# Altium project pca20035.PrjPCB (part 3 of 4)

## Sheet pca20035_sheet6_interface.SchDoc: Thingy:91 Interface
size A3; Organization: Nordic Semiconductor; DocumentNumber: 6; Revision: 1.6.0; SheetNumber: 6; SheetTotal: 6; Author: RUBR; CompanyName: Nordic Semiconductor; DrawnBy: RUBR; DocumentSize: A3; ProjectName: nRF91 Thingy
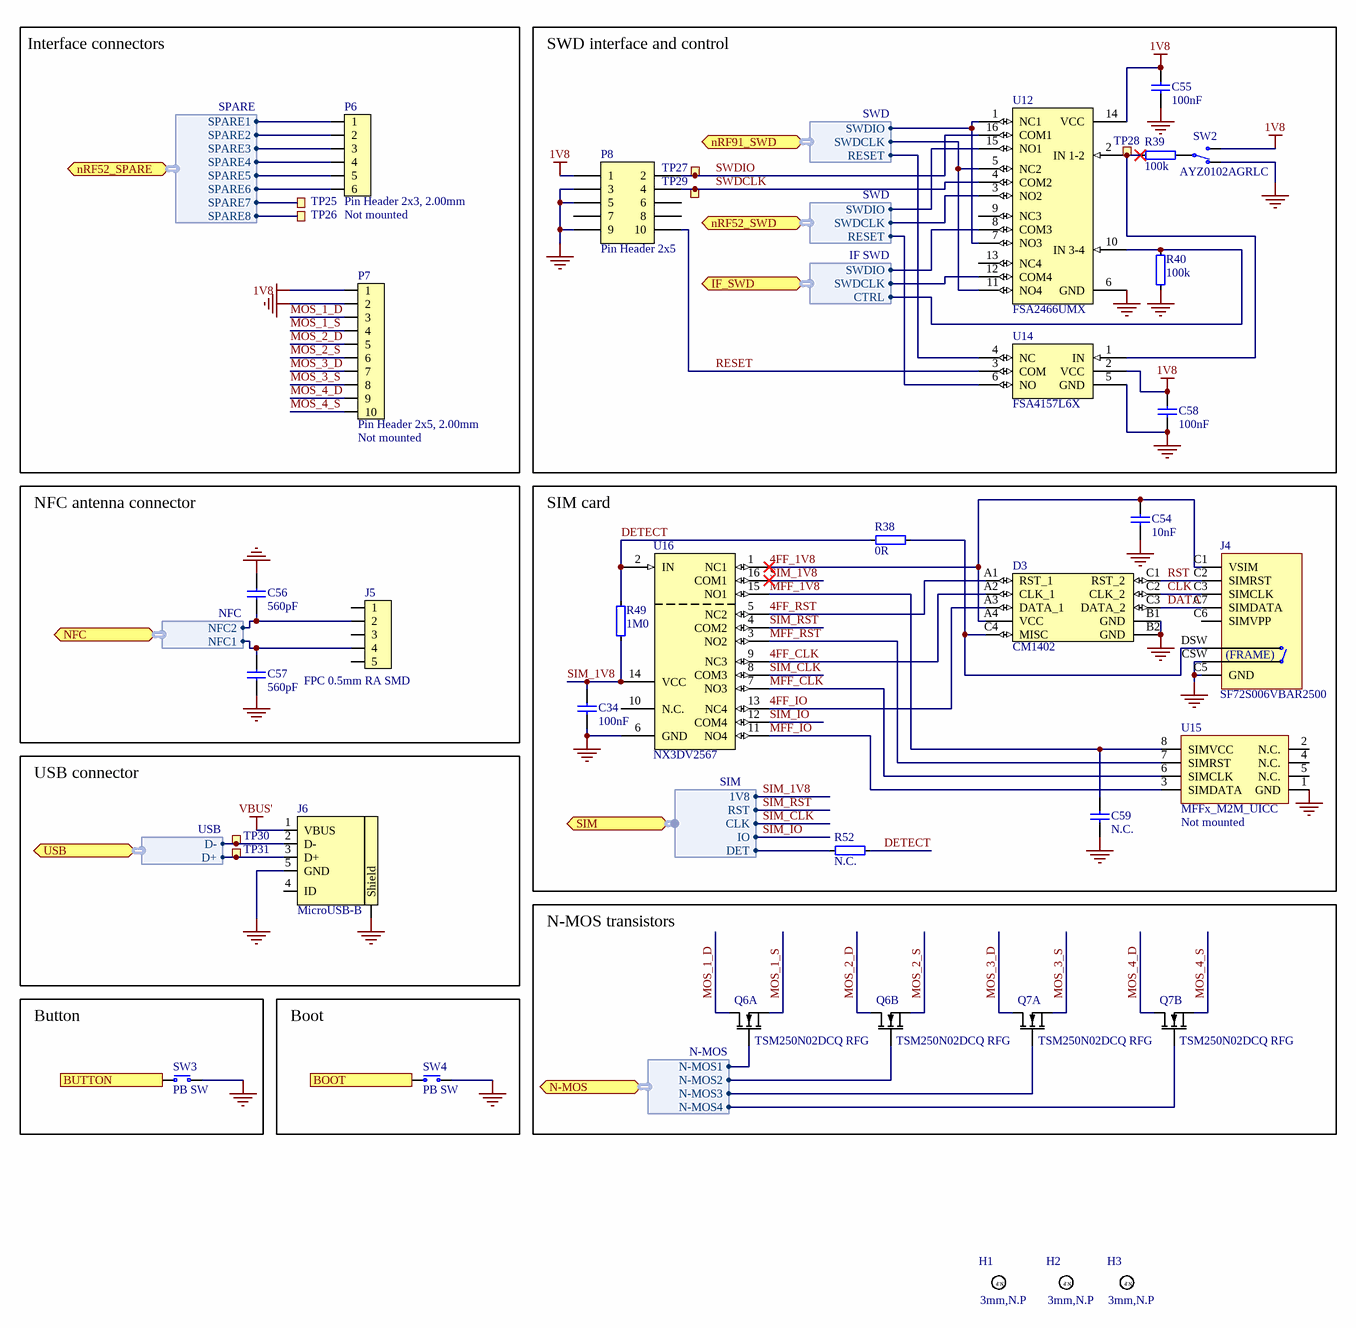
[diagram p4: pca20035_sheet6_interface.SchDoc]

### Parts
C34  100nF  [CAPC0603X03L_C]
C54  10nF  [CAPC0603X03L_C]
C55  100nF  [CAPC0603X03L_C]
C56  560pF  [CAPC0603X03L_C]
C57  560pF  [CAPC0603X03L_C]
C58  100nF  [CAPC0603X03L_C]
C59  N.C.  [CAPC0603X03L_C_NC]
D3  CM1402  [CM1402]
H1  3mm,N.P  [HOLE_NP_3MM]  (no BOM)
H2  3mm,N.P  [HOLE_NP_3MM]  (no BOM)
H3  3mm,N.P  [HOLE_NP_3MM]  (no BOM)
J4  SF72S006VBAR2500  [SF72S006VBAR2500]
J5  FPC 0.5mm RA SMD  [FPC_05P-0.5mm-RA-SMD]
J6  MicroUSB-B  [USB-Micro-B-RA-SMD-PiP]
P6  Pin Header 2x3, 2.00mm  Assembly: Not mounted  [HDR_2x3_TH_2.00MM-NC]
P7  Pin Header 2x5, 2.00mm  Assembly: Not mounted  [HDR_2x5_TH_2.00MM-NC]
P8  Pin Header 2x5  [HDR_2x5-SMD-1.27mm-ANG]
Q6  TSM250N02DCQ RFG  [DFN65P200X200X80_HS-6N]  (parts A,B of 2)
Q7  TSM250N02DCQ RFG  [DFN65P200X200X80_HS-6N]  (parts A,B of 2)
R38  0R  [RESC0603X03L_C]
R39  100k  [RESC0603X03L_C]
R40  100k  [RESC0603X03L_C]
R49  1M0  [RESC0603X03L_C]
R52  N.C.  [RESC0603X03L_C_NC]
SW2  AYZ0102AGRLC  [AYZ0102AGRLC]
SW3  PB SW  [Switch-PB-6.2x6.3mm-SMD]
SW4  PB SW  [SW_TACTILE_2.6x3.0MM_4-LEAD]
TP25  Ø1.0mm,SMD  [TP_SMD_Ø1.0mm]  (value not drawn)  (no BOM)
TP26  Ø1.0mm,SMD  [TP_SMD_Ø1.0mm]  (value not drawn)  (no BOM)
TP27  Ø1.5mm,SMD  [TP_SMD_Ø1.5mm]  (value not drawn)  (no BOM)
TP28  Ø1.5mm,SMD  [TP_SMD_Ø1.5mm]  (value not drawn)  (no BOM)
TP29  Ø1.5mm,SMD  [TP_SMD_Ø1.5mm]  (value not drawn)  (no BOM)
TP30  Ø1.5mm,SMD  [TP_SMD_Ø1.5mm]  (value not drawn)  (no BOM)
TP31  Ø1.5mm,SMD  [TP_SMD_Ø1.5mm]  (value not drawn)  (no BOM)
U12  FSA2466UMX  [XQFN40P180X260X50-16N]
U14  FSA4157L6X  [PSON50P100X60-6N]
U15  MFFx_M2M_UICC  Assembly: Not mounted  [SON127P600X90_HS-8N]
U16  NX3DV2567  [XQFN40P180X260X50-16N]

### Blocks framed on the sheet
Interface connectors: P6 P7 TP25 TP26
SWD interface and control: C55 C58 P8 R39 R40 SW2 TP27-TP29 U12 U14
NFC antenna connector: C56 C57 J5
SIM card: C34 C54 C59 D3 J4 R38 R49 R52 U15 U16
USB connector: J6 TP30 TP31
N-MOS transistors: Q6 Q7
Button: SW3
Boot: SW4

### Ports
BOOT (out), BUTTON (out), IF_SWD (bidir, harness IF SWD), N-MOS (bidir, harness N-MOS), NFC (bidir, harness NFC), nRF52_SPARE (bidir, harness SPARE), nRF52_SWD (bidir, harness SWD), nRF91_SWD (bidir, harness SWD), SIM (bidir, harness SIM), USB (bidir, harness USB)

### Harnesses
SWD: SWDIO, SWDCLK, RESET
IF SWD: SWDIO, SWDCLK, CTRL
NFC: NFC2, NFC1
N-MOS: N-MOS1, N-MOS2, N-MOS3, N-MOS4
SPARE: SPARE1, SPARE2, SPARE3, SPARE4, SPARE5, SPARE6, SPARE7, SPARE8
USB: D-, D+
SIM: DET, RST, CLK, IO, 1V8

### Nets
1V8: C55.1 C58.1 P7.1 P8.1 SW2.3(N.O) U12.14(VCC) U14.2(VCC)
GND: C34.1 C54.2 C55.2 C56.2 C57.1 C58.2 C59.1 D3.B1(GND) D3.B2(GND) J4.0(GND) J4.C5(GND) J4.CSW J6.5(GND) J6.6(Shield) P7.2 P8.3 P8.5 P8.9 R40.2 SW2.1(N.C) SW3.1(N.O) SW4.1(N.O) U12.6(GND) U14.5(GND) U15.1(GND) U16.6(GND)
VBUS': J6.1(VBUS)
4FF_1V8: C54.1 D3.A4(VCC) J4.C1(VSIM) U16.1(NC1)
4FF_CLK: D3.A2(CLK_1) U16.9(NC3)
4FF_IO: D3.A3(DATA_1) U16.13(NC4)
4FF_RST: D3.A1(RST_1) U16.5(NC2)
CLK: D3.C2(CLK_2) J4.C3(SIMCLK)
D_N: J6.2(D-) TP30.1 ; port USB.D-
D_P: J6.3(D+) TP31.1 ; port USB.D+
DATA: D3.C3(DATA_2) J4.C7(SIMDATA)
DETECT: R38.2 R49.1 R52.1 U16.2(IN)
MFF_1V8: C59.2 U15.8(SIMVCC) U16.15(NO1)
MFF_CLK: U15.6(SIMCLK) U16.7(NO3)
MFF_IO: U15.3(SIMDATA) U16.11(NO4)
MFF_RST: U15.7(SIMRST) U16.3(NO2)
MOS_1_D: P7.3 Q6.6(D1)
MOS_1_S: P7.4 Q6.1(S1)
MOS_2_D: P7.5 Q6.3(D2)
MOS_2_S: P7.6 Q6.4(S2)
MOS_3_D: P7.7 Q7.6(D1)
MOS_3_S: P7.8 Q7.1(S1)
MOS_4_D: P7.9 Q7.3(D2)
MOS_4_S: P7.10 Q7.4(S2)
nRF52_P0.03: TP25.1 ; port nRF52_SPARE.SPARE7
nRF52_P0.05: P6.2 ; port nRF52_SPARE.SPARE2
nRF52_P0.06: P6.1 ; port nRF52_SPARE.SPARE1
nRF52_P0.09: C57.2 J5.4 ; port NFC.NFC1
nRF52_P0.10: C56.1 J5.2 ; port NFC.NFC2
nRF52_P0.14: U12.8(COM3) ; port IF_SWD.SWDIO
nRF52_P0.17: R40.1 U12.10(IN_3-4) ; port IF_SWD.CTRL
nRF52_P0.26: P6.3 ; port nRF52_SPARE.SPARE3
nRF52_P0.27: P6.4 ; port nRF52_SPARE.SPARE4
nRF52_P0.28: P6.5 ; port nRF52_SPARE.SPARE5
nRF52_P0.30: P6.6 ; port nRF52_SPARE.SPARE6
nRF52_P1.05: U12.12(COM4) ; port IF_SWD.SWDCLK
nRF52_P1.11: TP26.1 ; port nRF52_SPARE.SPARE8
nRF52_P1.13: SW4.2(COM) ; port BOOT
nRF52_RST: U14.6(NO) ; port nRF52_SWD.RESET
nRF52_SWDCLK: U12.3(NO2) ; port nRF52_SWD.SWDCLK
nRF52_SWDIO: U12.15(NO1) ; port nRF52_SWD.SWDIO
nRF91_RST: U14.4(NC) ; port nRF91_SWD.RESET
nRF91_SWDCLK: U12.5(NC2) U12.11(NO4) ; port nRF91_SWD.SWDCLK
nRF91_SWDIO: U12.1(NC1) U12.7(NO3) ; port nRF91_SWD.SWDIO
P0.13/AIN0: Q6.2(G1) ; port N-MOS.N-MOS1
P0.14/AIN1: Q6.5(G2) ; port N-MOS.N-MOS2
P0.15/AIN2: Q7.2(G1) ; port N-MOS.N-MOS3
P0.16/AIN3: Q7.5(G2) ; port N-MOS.N-MOS4
P0.26: SW3.2(COM) ; port BUTTON
RESET: P8.10 U14.3(COM)
RST: D3.C1(RST_2) J4.C2(SIMRST)
SIM_1V8: C34.2 R49.2 U16.14(VCC) U16.16(COM1) ; port SIM.1V8
SIM_CLK: U16.8(COM3) ; port SIM.CLK
SIM_DET: R52.2 ; port SIM.DET
SIM_IO: U16.12(COM4) ; port SIM.IO
SIM_RST: U16.4(COM2) ; port SIM.RST
SWDCLK: P8.4 TP29.1 U12.4(COM2)
SWDIO: P8.2 TP27.1 U12.16(COM1)
NetD3_C4: D3.C4(MISC) J4.DSW R38.1
NetR39_1: R39.1 SW2.2(COM)
NetR39_2: R39.2 TP28.1 U12.2(IN_1-2) U14.1(IN)

Not connected (* = marked no-connect by the designer): H1 1; H2 1; H3 1; J4 C6(SIMVPP); J5 1 3 5; J6 4(ID); P8 6 7 8; U12 9(NC3) 13(NC4); U15 2(N.C.) 4(N.C.) 5(N.C.); U16 10(N.C.)

### Notes on the sheet
- Size
- Date:
- A3
- Project Number
- Sheet         of
- Revision
- File:
- Drawn By:
- (in symbol Hole_3MM_NP) N.P
- (in symbol SF72S006VBAR2500) (FRAME)

### Library data of the parts
C34 C55 C58 = C0201-100n: as C2 on sheet pca20035_sheet2_nrf91_mcu; Part Number: C0201-100n; Manufacturer Part Number: N.A.; ComponentLink1URL: N.A.; ComponentLink1Description: Datasheet; ComponentLink2URL: N.A.; ComponentLink2Description: Supplier link; HelpURL: N.A.; Footprint Doc: 0201; LatestRevisionDate: 2017-11-09; Published: 2014-11-13; Value: 100nF; Artikkelnr Noca: N.A.; Supplier 1: N.A.; Supplier Part Number 1: N.A.; Supplier 2: N.A.; Supplier Part Number 2: N.A.; Component Class: Capacitors; PartId: 100200078
C54 = C0201-10n: Capacitor, X7R, ±10%; Manufacturer: N.A.; Part number IPS: 00000003480; Note: 10V; Pad Count: 2; Part Number: C0201-10n; Manufacturer Part Number: N.A.; Footprint Doc: 0201; LatestRevisionDate: 2017-11-09; Published: 2014-11-13; Value: 10nF; Artikkelnr Noca: N.A.; ComponentLink1URL: N.A.; ComponentLink1Description: Datasheet; ComponentLink2URL: N.A.; ComponentLink2Description: Supplier link; HelpURL: N.A.; Supplier 1: N.A.; Supplier Part Number 1: N.A.; Supplier 2: N.A.; Supplier Part Number 2: N.A.; Component Class: Capacitors; PartId: 100200067
C56 C57 = C0201-560p: Capacitor, NP0, ±5%, 25V; Manufacturer: N.A.; Part number IPS: 00000001808; Pad Count: 2; Part Number: C0201-560p; Manufacturer Part Number: N.A.; Footprint Doc: 0201; LatestRevisionDate: 2020-12-16; Published: 2014-11-13; Value: 560pF; Note: 25V; Artikkelnr Noca: N.A.; ComponentLink1URL: N.A.; ComponentLink1Description: Datasheet; ComponentLink2URL: N.A.; ComponentLink2Description: Supplier link; HelpURL: N.A.; Supplier 1: N.A.; Supplier Part Number 1: N.A.; Supplier 2: N.A.; Supplier Part Number 2: N.A.; Component Class: Capacitors; PartId: 100200053
C59 = C0201-N.C.: Not mounted; Manufacturer: N.A.; Note: Chip Cap; Assembly: Not mounted; Pad Count: 2; Part Number: C0201-N.C.; Manufacturer Part Number: N.A.; ComponentLink1URL: N.A.; ComponentLink1Description: Datasheet; ComponentLink2URL: N.A.; ComponentLink2Description: Supplier link; HelpURL: N.A.; Footprint Doc: 0201; LatestRevisionDate: 2014-11-13; Published: 2014-11-13; Value: N.C.; Artikkelnr Noca: N.A.; Part number IPS: N.A.; Supplier 1: N.A.; Supplier Part Number 1: N.A.; Supplier 2: N.A.; Supplier Part Number 2: N.A.; Component Class: Capacitors; PartId: 100200001
D3 = CM1402: EMI Network Filter Arrays SIM CARD EMI FILTER WITH ESD PROTECTION; Manufacturer: ON Semiconductor; Manufacturer Part Number: CM1402-03CP; Part number IPS: 00000009949; Note: N.A.; Pad Count: 10; Part Number: CM1402; Footprint Doc: CM1402; LatestRevisionDate: 2017-02-06; Published: 2017-02-06; Value: CM1402; Artikkelnr Noca: N.A.; ComponentLink1URL: N.A.; ComponentLink1Description: Datasheet; ComponentLink2URL: N.A.; ComponentLink2Description: Supplier link; HelpURL: http://www.onsemi.com/pub_link/Collateral/CM1402-D.PDF; Supplier 1: Digi-Key; Supplier Part Number 1: CM1402-03CPOSTR-ND; Supplier 2: Mouser; Supplier Part Number 2: 748-CM1402-03CP; Component Class: Semiconductors; PartId: 101300139
H1-H3 = Hole_3MM_NP: Regular Non-Plated, 3mm hole; Manufacturer: Nordic Semiconductor; Manufacturer Part Number: N.A.; Pad Count: 1; Part Number: Hole_3MM_NP; Footprint Doc: Hole_3MM_NP; LatestRevisionDate: 2009-12-12; Published: 2009-12-12; Value: 3mm,N.P; Note: Regular Non-Plated, 3mm hole; Artikkelnr Noca: N.A.; Part number IPS: N.A.; ComponentLink1URL: N.A.; ComponentLink1Description: Datasheet; ComponentLink2URL: N.A.; ComponentLink2Description: Supplier link; HelpURL: N.A.; Supplier 1: N.A.; Supplier Part Number 1: N.A.; Supplier 2: N.A.; Supplier Part Number 2: N.A.; Component Class: Connectors; PartId: 100500145
J4 = SF72S006VBAR2500: n 8 (6 + 2) Position Card Connector NANO SIM Surface Mount, Right Angle Gold; Manufacturer: JAE Electronics; Part number IPS: 00000009956; Note: N.A.; Pad Count: 8; Part Number: SF72S006VBAR2500; Manufacturer Part Number: SF72S006VBAR2500; Footprint Doc: SF72S006VBAR2500; LatestRevisionDate: 2016-09-09; Published: 2016-09-09; Value: SF72S006VBAR2500; Artikkelnr Noca: N.A.; ComponentLink1URL: N.A.; ComponentLink1Description: Datasheet; ComponentLink2URL: N.A.; ComponentLink2Description: Supplier link; HelpURL: http://jae-connectors.com/en/pdf/MB-0282-1E_SF72.pdf; Supplier 1: Digi-Key; Supplier Part Number 1: 670-2799-1-ND; Supplier 2: Mouser; Supplier Part Number 2: 656-SF72S006VBAR2500; Component Class: Connectors; PartId: 100500572
J5 = FPC_05P-0.5mm-RA-SMD: 0.5mm FPC, 5P,Right Angle SMT,Double Contact,H=1.2mm,White, Tin plated; Manufacturer: W-CON; Manufacturer Part Number: 5141-05RZDNWR01; Part number IPS: 00000007792; Note: N.A.; Artikkelnr Noca: 55010020; Pad Count: 7; Part Number: FPC_05P-0.5mm-RA-SMD; Footprint Doc: FPC_05P-0.5mm-RA-SMD; LatestRevisionDate: 2016-04-21; Published: 2015-06-22; Value: FPC 0.5mm RA SMD; ComponentLink1URL: N.A.; ComponentLink1Description: Datasheet; ComponentLink2URL: N.A.; ComponentLink2Description: Supplier link; HelpURL: \\hizz\pro\app9717\Datasheet\connectors\W-CON\5141-XXRZDNXX0X.pdf; Supplier 1: Cabcon; Supplier Part Number 1: 5141-05RZDNWR01; Supplier 2: Digi-Key; Supplier Part Number 2: WM9836CT-ND; Component Class: Connectors; PartId: 100500528
J6 = USB-Micro-B-RA-SMD-PiP: MicroUSB-B-SMT; Manufacturer: Allen Creations Corp.; Manufacturer Part Number: AJU55-BS2111-L; Part number IPS: 00000007790; Note: N.A.; Artikkelnr Noca: 55029020; Pad Count: 5; Part Number: USB-Micro-B-RA-SMD-PiP; Footprint Doc: USB-Micro-B-RA-SMD-PiP; LatestRevisionDate: 2016-04-21; Published: 2014-10-07; Value: MicroUSB-B; ComponentLink1URL: N.A.; ComponentLink1Description: Datasheet; ComponentLink2URL: N.A.; ComponentLink2Description: Supplier link; HelpURL: \\hizz\pro\app9717\Datasheet\connectors\Allen Creations Corp\AJU-211.pdf; Supplier 1: Cabcon; Supplier Part Number 1: AJU55-BS2111-L; Supplier 2: Digi-Key; Supplier Part Number 2: 609-4616-1-ND; Component Class: Connectors; PartId: 100500490
P6 = Pin Header 2x3 TH, 2.00mm, N.C.: Pin Header 2x3, TH, 2.00mm; Manufacturer: N.A.; Pad Count: 6; Part Number: Pin Header 2x3 TH, 2.00mm, N.C.; Manufacturer Part Number: N.A.; ComponentLink1URL: N.A.; ComponentLink1Description: Datasheet; ComponentLink2URL: N.A.; ComponentLink2Description: Supplier link; HelpURL: N.A.; Footprint Doc: HDR_2x3_TH_2.00MM-NC; LatestRevisionDate: 2019-01-21; Published: 2019-01-21; Value: Pin Header 2x3, 2.00mm; Note: N.A.; Supplier 1: N.A.; Supplier Part Number 1: N.A.; Supplier 2: N.A.; Supplier Part Number 2: N.A.; Artikkelnr Noca: N.A.; Part number IPS: N.A.; Component Class: Connectors; PartId: 100500247
P7 = Pin Header 2x5 TH, 2.00mm, N.C.: Pin Header 2x5, TH, 2.00mm; Manufacturer: N.A.; Pad Count: 6; Part Number: Pin Header 2x5 TH, 2.00mm, N.C.; Manufacturer Part Number: N.A.; ComponentLink1URL: N.A.; ComponentLink1Description: Datasheet; ComponentLink2URL: N.A.; ComponentLink2Description: Supplier link; HelpURL: N.A.; Footprint Doc: HDR_2x5_TH_2.00MM-NC; LatestRevisionDate: 2019-01-21; Published: 2019-01-21; Value: Pin Header 2x5, 2.00mm; Note: N.A.; Supplier 1: N.A.; Supplier Part Number 1: N.A.; Supplier 2: N.A.; Supplier Part Number 2: N.A.; Artikkelnr Noca: N.A.; Part number IPS: N.A.; Component Class: Connectors; PartId: 100500264
P8 = Pin Header 2x5 SMD, 1.27mm, Angled: Pin Header 2x5, 1.27mm (50mil); Manufacturer: W-CON; Manufacturer Part Number: 1325B-1205S0Z080CR02; Part number IPS: 00000007800; Note: N.A.; Pad Count: 10; Part Number: Pin Header 2x5 SMD, 1.27mm, Angled; LatestRevisionDate: 2019-11-20; Published: 2014-01-22; Value: Pin Header 2x5; Artikkelnr Noca: N.A.; Footprint Doc: HDR_2x5-SMD-1.27mm-ANG; ComponentLink1URL: N.A.; ComponentLink1Description: Datasheet; ComponentLink2URL: N.A.; ComponentLink2Description: Supplier link; HelpURL: \\hizz\pro\app9717\Datasheet\connectors\W-CON\1325B-12XXXXZXXXCXXX.pdf; Supplier 1: Cabcon; Supplier Part Number 1: 1325B-1205S0Z080CR02; Supplier 2: Samtec; Supplier Part Number 2: FTSH-105-01-L-DH-A-C-TR; Component Class: Connectors; PartId: 100500257
Q6 Q7 = TSM250N02DCQ RFG: Dual N Ch MOFET, 5.8A, 55mOhm max, 620mW; Manufacturer: Taiwan Semiconductor; Part number IPS: 00000001703; Note: N.A.; Pad Count: 6; Part Number: TSM250N02DCQ RFG; Manufacturer Part Number: TSM250N02DCQ RFG; Footprint Doc: VDFN-6; LatestRevisionDate: 2018-10-31; Published: 2018-10-31; Value: TSM250N02DCQ RFG; Artikkelnr Noca: N.A.; ComponentLink1URL: https://www.taiwansemi.com/products/datasheet/TSM250N02D_B15.pdf; ComponentLink1Description: Datasheet; ComponentLink2URL: N.A.; ComponentLink2Description: Supplier link; HelpURL: https://www.taiwansemi.com/products/datasheet/TSM250N02D_B15.pdf; Supplier 1: Digi-Key; Supplier Part Number 1: TSM250N02DCQRFGCT-ND; Supplier 2: N.A.; Supplier Part Number 2: N.A.; Component Class: Semiconductors; PartId: 101300161
R38 = R0201-0R: Resistor, ±5%, 0.05W; Manufacturer: N.A.; Part number IPS: 00000003245; Note: Chip Res 5%; Pad Count: 2; Part Number: R0201-0R; Manufacturer Part Number: N.A.; Footprint Doc: 0201; LatestRevisionDate: 2017-11-09; Published: 2014-11-13; Value: 0R; Artikkelnr Noca: N.A.; ComponentLink1URL: N.A.; ComponentLink1Description: Datasheet; ComponentLink2URL: N.A.; ComponentLink2Description: Supplier link; HelpURL: N.A.; Supplier 1: N.A.; Supplier Part Number 1: N.A.; Supplier 2: N.A.; Supplier Part Number 2: N.A.; Component Class: Resistors; PartId: 100100001
R39 R40 = R0201-100k: Resistor, ±1%, 0.05W; Manufacturer: N.A.; Part number IPS: 00000001419; Note: Chip Res 1%; Pad Count: 2; Part Number: R0201-100k; Manufacturer Part Number: N.A.; Footprint Doc: 0201; LatestRevisionDate: 2014-11-13; Published: 2014-11-13; Value: 100k; Artikkelnr Noca: N.A.; ComponentLink1URL: N.A.; ComponentLink1Description: Datasheet; ComponentLink2URL: N.A.; ComponentLink2Description: Supplier link; HelpURL: N.A.; Supplier 1: N.A.; Supplier Part Number 1: N.A.; Supplier 2: N.A.; Supplier Part Number 2: N.A.; Component Class: Resistors; PartId: 100100080
R49 = R0201-1M0: as R4 on sheet pca20035_sheet2_nrf91_mcu; Part Number: R0201-1M0; Manufacturer Part Number: N.A.; Footprint Doc: 0201; LatestRevisionDate: 2014-11-13; Published: 2014-11-13; Value: 1M0; Artikkelnr Noca: N.A.; ComponentLink1URL: N.A.; ComponentLink1Description: Datasheet; ComponentLink2URL: N.A.; ComponentLink2Description: Supplier link; HelpURL: N.A.; Supplier 1: N.A.; Supplier Part Number 1: N.A.; Supplier 2: N.A.; Supplier Part Number 2: N.A.; Component Class: Resistors; PartId: 100100093
R52 = R0201-N.C.: Not mounted; Manufacturer: N.A.; Assembly: Not mounted; Note: Chip Res; Pad Count: 2; Part Number: R0201-N.C.; Manufacturer Part Number: N.A.; Footprint Doc: 0201; LatestRevisionDate: 2014-11-13; Published: 2014-11-13; Value: N.C.; Artikkelnr Noca: N.A.; Part number IPS: N.A.; ComponentLink1URL: N.A.; ComponentLink1Description: Datasheet; ComponentLink2URL: N.A.; ComponentLink2Description: Supplier link; HelpURL: N.A.; Supplier 1: N.A.; Supplier Part Number 1: N.A.; Supplier 2: N.A.; Supplier Part Number 2: N.A.; PartId: 100100107; Component Class: Resistors
SW2 = AYZ0102AGRLC: Miniature slide switch, SPDT, Right-Angle, ON-ON, 12V, 100mA; Manufacturer: C&K; Part number IPS: 00000002488; Note: N.A.; Pad Count: 3; Part Number: AYZ0102AGRLC; Manufacturer Part Number: AYZ0102AGRLC; ComponentLink1URL: https://www.ckswitches.com/media/1431/ayz.pdf; ComponentLink1Description: Datasheet; ComponentLink2URL: N.A.; ComponentLink2Description: Supplier link; Footprint Doc: AYZ0102AGRLC; LatestRevisionDate: 2019-05-08; Published: 2019-05-08; Value: AYZ0102AGRLC; Artikkelnr Noca: N.A.; Supplier 1: Digi-Key; Supplier Part Number 1: 401-2012-1-ND; Supplier 2: N.A.; Supplier Part Number 2: N.A.; HelpURL: https://www.ckswitches.com/media/1431/ayz.pdf; Component Class: Switches; PartId: 101500120
SW3 = Switch-PB-6.2x6.3mm-SMD: Tactile Switch, SPNO, SMD, 160gf, 6.2x6.3x2.5mm; Manufacturer: Dailywell; Manufacturer Part Number: TS604VM1-025BR-R; Part number IPS: 00000007812; Note: N.A.; Artikkelnr Noca: 50019106; Pad Count: 4; Part Number: Switch-PB-6.2x6.3mm-SMD; Footprint Doc: Switch-PB-6.2x6.3mm-SMD; LatestRevisionDate: 2016-04-21; Published: 2010-02-01; Value: PB SW; ComponentLink1URL: N.A.; ComponentLink1Description: Datasheet; ComponentLink2URL: N.A.; ComponentLink2Description: Supplier link; HelpURL: \\hizz\pro\app9717\Datasheet\switches\Dailywell\TS604VM1-025BR-R.pdf; Supplier 1: Cabcon; Supplier Part Number 1: TS604VM1-025BR-R; Supplier 2: Mouser; Supplier Part Number 2: 688-SKHUALE010; Component Class: Switches; PartId: 101500001
SW4 = KMT021 NGJ LHS: Nano-Miniature Top Actuated Tact Switch with extended life 3.0x2.6mm; Manufacturer: C&K; Part number IPS: 00000005416; Note: N.A.; Pad Count: 4; Part Number: KMT021 NGJ LHS; Manufacturer Part Number: KMT021 NGJ LHS; ComponentLink1URL: N.A.; ComponentLink1Description: Datasheet; ComponentLink2URL: N.A.; ComponentLink2Description: Supplier link; HelpURL: http://media.digikey.com/pdf/Data%20Sheets/C&K/KMT_0xx_NGJ_LHS_Drawing.pdf; Footprint Doc: SW_TACTILE_2.6x3.0MM_4-LEAD; LatestRevisionDate: 2013-08-12; Published: 2013-08-12; Value: PB SW; Supplier 1: Digi-Key; Supplier Part Number 1: CKN10289CT-ND; Supplier 2: Farnell; Supplier Part Number 2: 190-8260; Artikkelnr Noca: N.A.; Component Class: Switches; PartId: 101500039
TP25 TP26 = TP_SMD_Ø1.0MM: as TP1 on sheet pca20035_sheet2_nrf91_mcu; Part Number: TP_SMD_Ø1.0MM; Footprint Doc: TP_SMD_Ø1.0mm; LatestRevisionDate: 2013-06-11; Published: 2013-06-11; Value: Ø1.0mm,SMD; Note: N.A.; Artikkelnr Noca: N.A.; Part number IPS: N.A.; ComponentLink1URL: N.A.; ComponentLink1Description: Datasheet; ComponentLink2URL: N.A.; ComponentLink2Description: Supplier link; HelpURL: N.A.; Supplier 1: N.A.; Supplier Part Number 1: N.A.; Supplier 2: N.A.; Supplier Part Number 2: N.A.; Component Class: Connectors; PartId: 100500475
TP27-TP31 = TP_SMD_Ø1.5MM: as TP32 on sheet pca20035_sheet2_nrf91_mcu; Part Number: TP_SMD_Ø1.5MM; Footprint Doc: TP_SMD_Ø1.5mm; LatestRevisionDate: 2016-06-02; Published: 2016-06-02; Value: Ø1.5mm,SMD; Note: N.A.; Artikkelnr Noca: N.A.; Part number IPS: N.A.; ComponentLink1URL: N.A.; ComponentLink1Description: Datasheet; ComponentLink2URL: N.A.; ComponentLink2Description: Supplier link; HelpURL: N.A.; Supplier 1: N.A.; Supplier Part Number 1: N.A.; Supplier 2: N.A.; Supplier Part Number 2: N.A.; Component Class: Connectors; PartId: 100500477
U12 = FSA2466UMX: Data / Audio Low-Voltage Dual DPDT Analog Switch; Manufacturer: ON Semiconductor; Part number IPS: 00000009986; Note: N.A.; Artikkelnr Noca: 15070069; Pad Count: 16; Part Number: FSA2466UMX; Manufacturer Part Number: FSA2466UMX; ComponentLink1URL: N.A.; ComponentLink1Description: Datasheet; ComponentLink2URL: N.A.; ComponentLink2Description: Supplier link; HelpURL: https://www.onsemi.com/pub/Collateral/FSA2466-D.PDF; Footprint Doc: UFQFN-16; LatestRevisionDate: 2019-05-15; Published: 2016-05-18; Value: FSA2466UMX; Supplier 1: Digi-Key; Supplier Part Number 1: FSA2466UMXCT-ND; Supplier 2: Mouser; Supplier Part Number 2: 512-FSA2466UMX; Component Class: Misc_ICs; PartId: 101900422
U14 = FSA4157L6X: Low-Voltage, SPDT Analog Switch, 1.65 V to 5.5 V; Manufacturer: ON Semiconductor; Part number IPS: 00000003748; Note: N.A.; Pad Count: 6; Part Number: FSA4157L6X; Manufacturer Part Number: FSA4157L6X; ComponentLink1URL: https://www.onsemi.com/pub/Collateral/FSA4157-D.pdf; ComponentLink1Description: Datasheet; ComponentLink2URL: https://www.digikey.com/product-detail/en/on-semiconductor/FSA4157L6X/FSA4157L6XCT-ND/821004; ComponentLink2Description: Supplier link; HelpURL: https://www.onsemi.com/pub/Collateral/FSA4157-D.pdf; Footprint Doc: UFDFN-6; LatestRevisionDate: 2020-04-29; Published: 2019-10-22; Value: FSA4157L6X; Supplier 1: Digi-Key; Supplier Part Number 1: FSA4157L6XCT-ND; Supplier 2: Mouser; Supplier Part Number 2: 512-FSA4157L6X; Artikkelnr Noca: N.A.; Component Class: Misc_ICs; PartId: 101900593
U15 = M2M_UICC: M2M UICC SIM Card; Manufacturer: N.A.; Pad Count: 8; Part Number: M2M_UICC; Manufacturer Part Number: N.A.; ComponentLink1URL: N.A.; ComponentLink1Description: Datasheet; ComponentLink2URL: N.A.; ComponentLink2Description: Supplier link; HelpURL: N.A.; Footprint Doc: SON-8; LatestRevisionDate: 2019-10-22; Published: 2019-10-22; Value: M2M UICC; Note: N.A.; Supplier 1: N.A.; Supplier Part Number 1: N.A.; Supplier 2: N.A.; Supplier Part Number 2: N.A.; Artikkelnr Noca: N.A.; Part number IPS: N.A.; Component Class: Misc_ICs; PartId: 101900595
U16 = NX3DV2567GU: Low-ohmic four-pole double-throw analog switch; Manufacturer: NXP Semiconductors; Part number IPS: 00000007816; Note: N.A.; Artikkelnr Noca: 15079317; Pad Count: 16; Part Number: NX3DV2567GU; Manufacturer Part Number: NX3DV2567GU; Footprint Doc: XQFN-16; LatestRevisionDate: 2015-02-17; Published: 2015-02-17; Value: NX3DV2567; ComponentLink1URL: N.A.; ComponentLink1Description: Datasheet; ComponentLink2URL: N.A.; ComponentLink2Description: Supplier link; HelpURL: http://www.nxp.com/documents/data_sheet/NX3DV2567.pdf; Supplier 1: Digi-Key; Supplier Part Number 1: 568-5206-1-ND; Supplier 2: Mouser; Supplier Part Number 2: 771-NX3DV2567GU115; Component Class: Misc_ICs; PartId: 101900290

## Sheet pca20035_sheet5_power_supply.SchDoc: Thingy:91 Power Supply
size A3; Organization: Nordic Semiconductor; DocumentNumber: 5; Revision: 1.6.0; SheetNumber: 5; SheetTotal: 6; Author: RUBR; CompanyName: Nordic Semiconductor; DrawnBy: RUBR; DocumentSize: A3; ProjectName: nRF91 Thingy
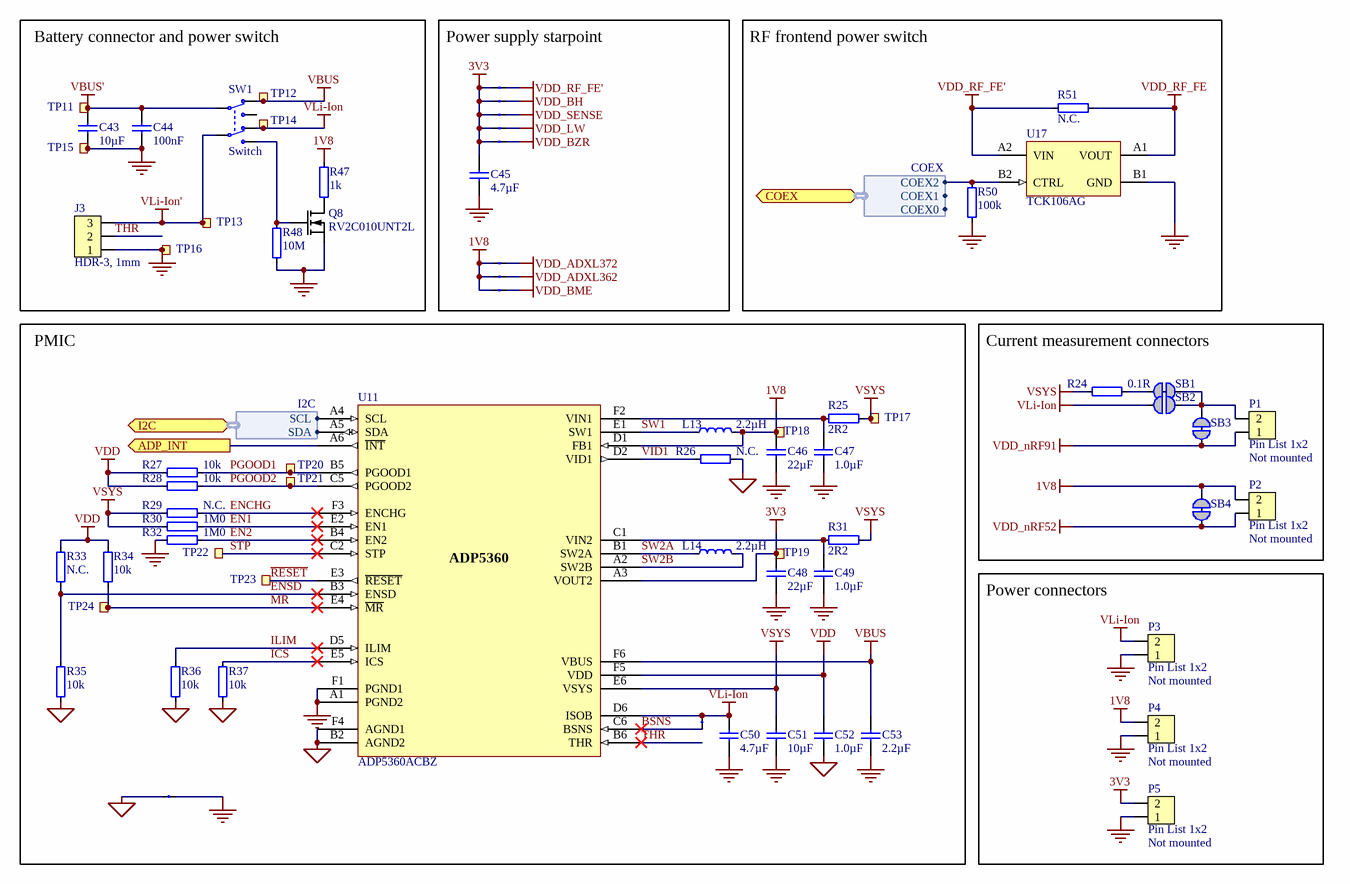
[diagram p5: pca20035_sheet5_power_supply.SchDoc]

### Parts
C43  10µF  [CAPC1608X06L]
C44  100nF  [CAPC0603X03L_C]
C45  4.7µF  [CAPC1608X06L]
C46  22µF  [CAPC1608X06L]
C47  1.0µF  [CAPC1005X04L]
C48  22µF  [CAPC1608X06L]
C49  1.0µF  [CAPC1608X06L]
C50  4.7µF  [CAPC1608X06L]
C51  10µF  [CAPC1608X06L]
C52  1.0µF  [CAPC1005X04L]
C53  2.2µF  [CAPC1608X06L]
J3  HDR-3, 1mm  [SM03B-SRSS-TB]
L13  2.2µH  [INDC2016X18N]
L14  2.2µH  [INDC2016X18N]
P1  Pin List 1x2  Assembly: Not mounted  [LIST_1x2-NC]
P2  Pin List 1x2  Assembly: Not mounted  [LIST_1x2-NC]
P3  Pin List 1x2  Assembly: Not mounted  [LIST_1x2-NC]
P4  Pin List 1x2  Assembly: Not mounted  [LIST_1x2-NC]
P5  Pin List 1x2  Assembly: Not mounted  [LIST_1x2-NC]
Q8  RV2C010UNT2L  [DFN65P100X40-3L]
R24  0.1R  [RESC1005X04L]
R25  2R2  [RESC1005X04L]
R26  N.C.  [RESC0603X03L_C_NC]
R27  10k  [RESC0603X03L_C]
R28  10k  [RESC0603X03L_C]
R29  N.C.  [RESC0603X03L_C_NC]
R30  1M0  [RESC0603X03L_C]
R31  2R2  [RESC1005X04L]
R32  1M0  [RESC0603X03L_C]
R33  N.C.  [RESC0603X03L_C_NC]
R34  10k  [RESC0603X03L_C]
R35  10k  [RESC0603X03L_C]
R36  10k  [RESC0603X03L_C]
R37  10k  [RESC0603X03L_C]
R47  1k  [RESC0603X03L_C]
R48  10M  [RESC0603X03L_C]
R50  100k  [RESC0603X03L_C]
R51  N.C.  [RESC0603X03L_C_NC]
SB1  Solderbridge  [Solderbridge_Shorted]  (value not drawn)  (net tie, no BOM)
SB2  Solderbridge  [Solderbridge]  (value not drawn)  (no BOM)
SB3  Solderbridge  [Solderbridge_Shorted]  (value not drawn)  (net tie, no BOM)
SB4  Solderbridge  [Solderbridge_Shorted]  (value not drawn)  (net tie, no BOM)
ST1  N.A.  [2 PIN STARPOINT]  (value not drawn)  (net tie, no BOM)
ST2  N.A.  [2 PIN STARPOINT]  (value not drawn)  (net tie, no BOM)
ST3  N.A.  [2 PIN STARPOINT]  (value not drawn)  (net tie, no BOM)
ST4  N.A.  [2 PIN STARPOINT]  (value not drawn)  (net tie, no BOM)
ST5  N.A.  [2 PIN STARPOINT]  (value not drawn)  (net tie, no BOM)
ST7  N.A.  [2 PIN STARPOINT]  (value not drawn)  (net tie, no BOM)
ST8  N.A.  [2 PIN STARPOINT]  (value not drawn)  (net tie, no BOM)
ST9  N.A.  [2 PIN STARPOINT]  (value not drawn)  (net tie, no BOM)
ST10  N.A.  [2 PIN STARPOINT]  (value not drawn)  (net tie, no BOM)
ST11  N.A.  [2 PIN STARPOINT]  (value not drawn)  (net tie, no BOM)
SW1  Switch  [Switch-Slide-RA-J-Lead-DPDT-8.5x3.5mm]
TP11  Ø1.5mm,SMD  [TP_SMD_Ø1.5mm]  (value not drawn)  (no BOM)
TP12  Ø1.5mm,SMD  [TP_SMD_Ø1.5mm]  (value not drawn)  (no BOM)
TP13  Ø1.5mm,SMD  [TP_SMD_Ø1.5mm]  (value not drawn)  (no BOM)
TP14  Ø1.5mm,SMD  [TP_SMD_Ø1.5mm]  (value not drawn)  (no BOM)
TP15  Ø1.5mm,SMD  [TP_SMD_Ø1.5mm]  (value not drawn)  (no BOM)
TP16  Ø1.5mm,SMD  [TP_SMD_Ø1.5mm]  (value not drawn)  (no BOM)
TP17  Ø1.5mm,SMD  [TP_SMD_Ø1.5mm]  (value not drawn)  (no BOM)
TP18  Ø1.5mm,SMD  [TP_SMD_Ø1.5mm]  (value not drawn)  (no BOM)
TP19  Ø1.5mm,SMD  [TP_SMD_Ø1.5mm]  (value not drawn)  (no BOM)
TP20  Ø1.5mm,SMD  [TP_SMD_Ø1.5mm]  (value not drawn)  (no BOM)
TP21  Ø1.5mm,SMD  [TP_SMD_Ø1.5mm]  (value not drawn)  (no BOM)
TP22  Ø1.0mm,SMD  [TP_SMD_Ø1.0mm]  (value not drawn)  (no BOM)
TP23  Ø1.0mm,SMD  [TP_SMD_Ø1.0mm]  (value not drawn)  (no BOM)
TP24  Ø1.0mm,SMD  [TP_SMD_Ø1.0mm]  (value not drawn)  (no BOM)
U11  ADP5360ACBZ  [BGA32C40P6X6_238X238X56]
U17  TCK106AG  [BGA4C40P2X2_76X76X62]

### Blocks framed on the sheet
Battery connector and power switch: C43 C44 J3 Q8 R47 R48 SW1 TP11-TP16
Power supply starpoint: C45 ST1-ST5 ST7-ST9
RF frontend power switch: R50 R51 U17
PMIC: C46-C53 L13 L14 R25-R37 ST10 ST11 TP17-TP24 U11
Current measurement connectors: P1 P2 R24 SB1-SB4
Power connectors: P3-P5

### Ports
ADP_INT (out), COEX (bidir, harness COEX), I2C (bidir, harness I2C)

### Harnesses
I2C: SDA, SCL
COEX: COEX2, COEX1, COEX0

### Nets
1V8: C46.2 L13.2 P2.2 P4.2 R47.1 SB4.2 ST7.1 ST8.1 ST9.1 TP18.1 U11.D1(FB1)
3V3: C45.2 C48.2 P5.2 ST1.1 ST2.1 ST3.1 ST4.1 ST5.1 TP19.1 U11.A3(VOUT2)
AGND: C52.1 R26.2 R35.1 R36.2 R37.2 ST11.1 U11.B2(AGND2) U11.F4(AGND1)
GND: C43.2 C44.2 C45.1 C46.1 C47.1 C48.1 C49.1 C50.1 C51.1 C53.1 J3.1 P3.1 P4.1 P5.1 Q8.2(S) R32.1 R48.2 R50.1 ST11.2 TP15.1 TP16.1 U11.A1(PGND2) U11.F1(PGND1) U17.B1(GND)
VBUS: C53.2 SW1.3(N.C-1) TP12.1 U11.F6(VBUS)
VBUS': C43.1 C44.1 SW1.2(COM-1) TP11.1
VDD: C52.2 R27.1 R28.1 R33.2 R34.1 U11.F5(VDD)
VDD_ADXL362: ST8.2
VDD_ADXL372: ST7.2
VDD_BH: ST2.2
VDD_BME: ST9.2
VDD_BZR: ST5.2
VDD_LW: ST4.2
VDD_nRF52: P2.1 SB4.1
VDD_nRF91: P1.1 SB3.1
VDD_RF_FE: R51.1 U17.A1(VOUT)
VDD_RF_FE': R51.2 ST1.2 U17.A2(VIN)
VDD_SENSE: ST3.2
VLi-Ion: C50.2 P3.2 SB2.2 ST10.2 SW1.6(N.C-2) TP14.1 U11.D6(ISOB)
VLi-Ion': J3.3 SW1.5(COM-2) TP13.1
VSYS: C51.2 R24.2 R25.2 R29.1 R30.1 R31.2 TP17.1 U11.E6(VSYS)
BSNS: ST10.1 U11.C6(BSNS)
EN1: R30.2 U11.E2(EN1)
EN2: R32.2 U11.B4(EN2)
ENCHG: R29.2 U11.F3(ENCHG)
ENSD: R33.1 R35.2 U11.B3(ENSD)
ICS: R37.1 U11.E5(ICS)
ILIM: R36.1 U11.D5(ILIM)
~{MR}: R34.2 TP24.1 U11.E4(~{MR})
nRF52_P1.01: R50.2 U17.B2(CTRL) ; port COEX.COEX2
nRF52_P1.08: U11.A5(SDA) ; port I2C.SDA
nRF52_P1.09: U11.A4(SCL) ; port I2C.SCL
P0.17/AIN4: U11.A6(~{INT}) ; port ADP_INT
PGOOD1: R27.2 TP20.1 U11.B5(PGOOD1)
PGOOD2: R28.2 TP21.1 U11.C5(PGOOD2)
~{RESET}: TP23.1 U11.E3(~{RESET})
STP: TP22.1 U11.C2(STP)
SW1: L13.1 U11.E1(SW1)
SW2A: L14.1 U11.B1(SW2A)
SW2B: L14.2 U11.A2(SW2B)
THR: J3.2 U11.B6(THR)
VID1: R26.1 U11.D2(VID1)
NetC47_2: C47.2 R25.1 U11.F2(VIN1)
NetC49_2: C49.2 R31.1 U11.C1(VIN2)
NetP1_2: P1.2 SB1.1 SB2.1 SB3.2
NetQ8_1: Q8.1(G) R48.1 SW1.4(N.O-2)
NetQ8_3: Q8.3(D) R47.2
NetR24_1: R24.1 SB1.2

Not connected (* = marked no-connect by the designer): SW1 1(N.O-1)

### Notes on the sheet
- Size
- Date:
- A3
- Project Number
- Sheet         of
- Revision
- File:
- Drawn By:
- (in symbol ADP5360ACBZ) ADP5360

### Library data of the parts
C43 C51 = C0603-10µ: Capacitor, X5R, ±20%; Manufacturer: N.A.; Part number IPS: 00000007785; Note: 6.3V; Artikkelnr Noca: 20039234; Pad Count: 2; Part Number: C0603-10µ; Manufacturer Part Number: N.A.; LatestRevisionDate: 2011-01-17; Published: 2011-01-17; Value: 10µF; Footprint Doc: 0603; ComponentLink1URL: N.A.; ComponentLink1Description: Datasheet; ComponentLink2URL: N.A.; ComponentLink2Description: Supplier link; HelpURL: N.A.; Supplier 1: N.A.; Supplier Part Number 1: N.A.; Supplier 2: N.A.; Supplier Part Number 2: N.A.; Component Class: Capacitors; PartId: 100200275
C44 = C0201-100n: Capacitor, X5R, ±10%; Manufacturer: N.A.; Part number IPS: 00000001248, 00000002505; Note: 16V; Pad Count: 2; Part Number: C0201-100n; Manufacturer Part Number: N.A.; LatestRevisionDate: 2017-11-09; Published: 2014-11-13; Value: 100nF; Artikkelnr Noca: N.A.; Footprint Doc: 0201; ComponentLink1URL: N.A.; ComponentLink1Description: Datasheet; ComponentLink2URL: N.A.; ComponentLink2Description: Supplier link; HelpURL: N.A.; Supplier 1: N.A.; Supplier Part Number 1: N.A.; Supplier 2: N.A.; Supplier Part Number 2: N.A.; Component Class: Capacitors; PartId: 100200078
C45 C50 = C0603-4µ7: Capacitor, X5R, ±10%; Manufacturer: N.A.; Part number IPS: 00000007783; Note: 6.3V; Artikkelnr Noca: 20069060; Pad Count: 2; Part Number: C0603-4µ7; Manufacturer Part Number: N.A.; Footprint Doc: 0603; LatestRevisionDate: 2009-11-23; Published: 2009-05-08; Value: 4.7µF; ComponentLink1URL: N.A.; ComponentLink1Description: Datasheet; ComponentLink2URL: N.A.; ComponentLink2Description: Supplier link; HelpURL: N.A.; Supplier 1: N.A.; Supplier Part Number 1: N.A.; Supplier 2: N.A.; Supplier Part Number 2: N.A.; Component Class: Capacitors; PartId: 100200274
C46 C48 = C0603-22µ-6.3V: Capacitor, X5R, ±20%, 6.3V; Manufacturer: Samsung Electro-Mechanics America; Manufacturer Part Number: CL10A226MQ8NRNC; Part number IPS: 00000007787; Artikkelnr Noca: N.A.; Pad Count: 2; Part Number: C0603-22µ-6.3V; Footprint Doc: 0603; LatestRevisionDate: 2015-04-10; Published: 2015-04-10; Value: 22µF; Note: 6.3V; ComponentLink1URL: N.A.; ComponentLink1Description: Datasheet; ComponentLink2URL: N.A.; ComponentLink2Description: Supplier link; HelpURL: http://www.samsungsem.com/kr/front/downloadcms.do?path=/kr/support/product-search/mlcc/__icsFiles/afieldfile/2014/11/05&fileName=S_CL10A226MQ8NRNC.pdf; Supplier 1: Digi-Key; Supplier Part Number 1: 1276-1193-1-ND; Supplier 2: N.A.; Supplier Part Number 2: N.A.; Component Class: Capacitors; PartId: 100200363
C47 C52 = C0402-1µ0: Capacitor, X5R, ±5%, 6.3V; Manufacturer: N.A.; Part number IPS: 00000007786, 00000003457; Artikkelnr Noca: 20039235; Pad Count: 2; Part Number: C0402-1µ0; Manufacturer Part Number: N.A.; Footprint Doc: 0402; LatestRevisionDate: 2016-08-22; Published: 2009-05-08; Value: 1.0µF; Note: 6.3V; ComponentLink1URL: N.A.; ComponentLink1Description: Datasheet; ComponentLink2URL: N.A.; ComponentLink2Description: Supplier link; HelpURL: N.A.; Supplier 1: Digi-Key; Supplier Part Number 1: 1276-1444-1-ND; Supplier 2: N.A.; Supplier Part Number 2: N.A.; Component Class: Capacitors; PartId: 100200190
C49 = C0603-1µ0: Capacitor, X7R, ±10%; Manufacturer: N.A.; Part number IPS: 00000000616; Note: 16V; Artikkelnr Noca: 20039282; Pad Count: 2; Part Number: C0603-1µ0; Manufacturer Part Number: N.A.; Footprint Doc: 0603; LatestRevisionDate: 2013-06-05; Published: 2009-05-08; Value: 1.0µF; ComponentLink1URL: N.A.; ComponentLink1Description: Datasheet; ComponentLink2URL: N.A.; ComponentLink2Description: Supplier link; HelpURL: N.A.; Supplier 1: N.A.; Supplier Part Number 1: N.A.; Supplier 2: N.A.; Supplier Part Number 2: N.A.; Component Class: Capacitors; PartId: 100200271
C53 = C0603-2µ2-10V: Capacitor, X7R, ±10%, 10V; Manufacturer: Samsung Electro-Mechanics America; Manufacturer Part Number: CL10B225KP8NNNC; Part number IPS: 00000001781; Artikkelnr Noca: 20030083; Pad Count: 2; Part Number: C0603-2µ2-10V; Footprint Doc: 0603; LatestRevisionDate: 2016-10-10; Published: 2016-10-10; Value: 2.2µF; Note: 10V; ComponentLink1URL: N.A.; ComponentLink1Description: Datasheet; ComponentLink2URL: N.A.; ComponentLink2Description: Supplier link; HelpURL: http://www.samsungsem.com/kr/front/downloadcms.do?path=/kr/support/product-search/mlcc/__icsFiles/afieldfile/2014/11/05&fileName=C_CL10B225KP8NNNC.pdf; Supplier 1: Digi-Key; Supplier Part Number 1: 1276-1134-1-ND; Supplier 2: N.A.; Supplier Part Number 2: N.A.; Component Class: Capacitors; PartId: 100200393
J3 = SM03B-SRSS-TB: 1.0mm pitch connector side entry SMD; Manufacturer: JST Sales America Inc.; Manufacturer Part Number: SM03B-SRSS-TB(LF)(SN); Part number IPS: 00000001785; Note: JST, Header; Artikkelnr Noca: N.A.; Pad Count: 3; Part Number: SM03B-SRSS-TB; Footprint Doc: SM03B-SRSS-TB; LatestRevisionDate: 2017-10-09; Published: 2017-10-09; Value: HDR-3, 1mm; ComponentLink1URL: N.A.; ComponentLink1Description: Datasheet; ComponentLink2URL: N.A.; ComponentLink2Description: Supplier link; HelpURL: http://www.jst-mfg.com/product/pdf/eng/eSH.pdf; Supplier 1: Cabcon; Supplier Part Number 1: SM03B-SRSS-TB(LF)(SN); Supplier 2: Digi-Key; Supplier Part Number 2: 455-1803-1-ND; Component Class: Connectors; PartId: 100500605
L13 L14 = L0806-2µ2-1.2A-110mOhm: Shielded Multilayer Inductor, 1.2A, ±20%, 110mOhm, Q=10 @ 1MHz; Manufacturer: Wurth Elektronik; Manufacturer Part Number: 74479776222A; Part number IPS: 80000001820; Note: N.A.; Pad Count: 2; Part Number: L0806-2µ2-1.2A-110mOhm; Footprint Doc: 0806; LatestRevisionDate: 2020-01-07; Published: 2019-01-11; Value: 2.2µH; Artikkelnr Noca: N.A.; ComponentLink1Description: Datasheet; ComponentLink2Description: Supplier link; ComponentLink1URL: https://katalog.we-online.de/pbs/datasheet/74479776222.pdf; ComponentLink2URL: N.A.; HelpURL: https://media.digikey.com/PDF/Data%20Sheets/Wurth%20Electronics%20PDFs/Passive_Components_Products_Catalog.pdf; Supplier 1: Digi-Key; Supplier Part Number 1: 732-2954-1-ND; Supplier 2: Mouser; Supplier Part Number 2: 710-74479776222; Component Class: Inductors; PartId: 100300125
P1-P5 = Pin List 1x2, N.C.: Pin List 1x2, 2.54mm (100mil); Manufacturer: N.A.; Pad Count: 2; Part Number: Pin List 1x2, N.C.; Manufacturer Part Number: N.A.; Footprint Doc: LIST_1x2; LatestRevisionDate: 2017-02-02; Published: 2017-01-30; Value: Pin List 1x2; Note: N.A.; Artikkelnr Noca: N.A.; Part number IPS: N.A.; ComponentLink1URL: N.A.; ComponentLink1Description: Datasheet; ComponentLink2URL: N.A.; ComponentLink2Description: Supplier link; HelpURL: N.A.; Supplier 1: N.A.; Supplier Part Number 1: N.A.; Supplier 2: N.A.; Supplier Part Number 2: N.A.; Component Class: Connectors; PartId: 100500298
Q8 = RV2C010UNT2L: N-Channel MOSFET, 20V, 1A, 470mOhm, 400mW; Manufacturer: Rohm Semiconductor; Part number IPS: 00000009976; Note: N.A.; Artikkelnr Noca: 35010020; Pad Count: 3; Part Number: RV2C010UNT2L; Manufacturer Part Number: RV2C010UNT2L; Footprint Doc: DFN-3; LatestRevisionDate: 2016-08-09; Published: 2016-08-09; Value: RV2C010UNT2L; ComponentLink1URL: N.A.; ComponentLink1Description: Datasheet; ComponentLink2URL: N.A.; ComponentLink2Description: Supplier link; HelpURL: http://rohmfs.rohm.com/en/products/databook/datasheet/discrete/transistor/mosfet/rv2c010unt2l-e.pdf; Supplier 1: Digi-Key; Supplier Part Number 1: RV2C010UNT2LCT-ND; Supplier 2: Mouser; Supplier Part Number 2: 755-RV2C010UNT2L; Component Class: Semiconductors; PartId: 101300132
R24 = R0402-0R1: Resistor, ±1%, 0.063W; Manufacturer: N.A.; Part number IPS: 00000001795; Note: Chip Res 1%; Pad Count: 2; Part Number: R0402-0R1; Manufacturer Part Number: N.A.; ComponentLink1URL: N.A.; ComponentLink1Description: Datasheet; ComponentLink2URL: N.A.; ComponentLink2Description: Supplier link; HelpURL: N.A.; Footprint Doc: 0402; LatestRevisionDate: 2012-06-22; Published: 2012-06-22; Value: 0.1R; Supplier 1: Digi-Key; Supplier Part Number 1: 311-.10PDKR-ND; Supplier 2: N.A.; Supplier Part Number 2: N.A.; Artikkelnr Noca: N.A.; Component Class: Resistors; PartId: 100100111
R25 R31 = R0402-2R2: Resistor, ±1%, 0.063W; Manufacturer: N.A.; Part number IPS: 00000001796; Note: Chip Res 1%; Artikkelnr Noca: 27049009; Pad Count: 2; Part Number: R0402-2R2; Manufacturer Part Number: N.A.; ComponentLink1URL: N.A.; ComponentLink1Description: Datasheet; ComponentLink2URL: N.A.; ComponentLink2Description: Supplier link; HelpURL: N.A.; Footprint Doc: 0402; LatestRevisionDate: 2012-06-22; Published: 2012-06-22; Value: 2R2; Supplier 1: N.A.; Supplier Part Number 1: N.A.; Supplier 2: N.A.; Supplier Part Number 2: N.A.; Component Class: Resistors; PartId: 100100116
R26 R29 R33 = R0201-N.C.: Not mounted; Manufacturer: N.A.; Note: Chip Res; Assembly: Not mounted; Pad Count: 2; Part Number: R0201-N.C.; Manufacturer Part Number: N.A.; LatestRevisionDate: 2014-11-13; Published: 2014-11-13; Value: N.C.; Artikkelnr Noca: N.A.; Footprint Doc: 0201; Part number IPS: N.A.; ComponentLink1URL: N.A.; ComponentLink1Description: Datasheet; ComponentLink2URL: N.A.; ComponentLink2Description: Supplier link; HelpURL: N.A.; Supplier 1: N.A.; Supplier Part Number 1: N.A.; Supplier 2: N.A.; Supplier Part Number 2: N.A.; Component Class: Resistors; PartId: 100100107
R27 R28 R34-R37 = R0201-10k: Resistor, ±1%, 0.05W; Manufacturer: N.A.; Part number IPS: 00000001255; Note: Chip Res 1%; Pad Count: 2; Part Number: R0201-10k; Manufacturer Part Number: N.A.; LatestRevisionDate: 2014-11-13; Published: 2014-11-13; Value: 10k; Artikkelnr Noca: N.A.; Footprint Doc: 0201; ComponentLink1URL: N.A.; ComponentLink1Description: Datasheet; ComponentLink2URL: N.A.; ComponentLink2Description: Supplier link; HelpURL: N.A.; Supplier 1: N.A.; Supplier Part Number 1: N.A.; Supplier 2: N.A.; Supplier Part Number 2: N.A.; Component Class: Resistors; PartId: 100100065
R30 R32 = R0201-1M0: Resistor, ±1%, 0.05W; Manufacturer: N.A.; Part number IPS: 00000001418; Note: Chip Res 1%; Pad Count: 2; Part Number: R0201-1M0; Manufacturer Part Number: N.A.; LatestRevisionDate: 2014-11-13; Published: 2014-11-13; Value: 1M0; Artikkelnr Noca: N.A.; Footprint Doc: 0201; ComponentLink1URL: N.A.; ComponentLink1Description: Datasheet; ComponentLink2URL: N.A.; ComponentLink2Description: Supplier link; HelpURL: N.A.; Supplier 1: N.A.; Supplier Part Number 1: N.A.; Supplier 2: N.A.; Supplier Part Number 2: N.A.; Component Class: Resistors; PartId: 100100093
R47 = R0201-1k0: Resistor, ±1%, 0.05W; Manufacturer: N.A.; Part number IPS: 00000005786; Note: Chip Res 1%; Pad Count: 2; Part Number: R0201-1k0; Manufacturer Part Number: N.A.; LatestRevisionDate: 2014-11-13; Published: 2014-11-13; Value: 1k; Artikkelnr Noca: N.A.; Footprint Doc: 0201; ComponentLink1URL: N.A.; ComponentLink1Description: Datasheet; ComponentLink2URL: N.A.; ComponentLink2Description: Supplier link; HelpURL: N.A.; Supplier 1: N.A.; Supplier Part Number 1: N.A.; Supplier 2: N.A.; Supplier Part Number 2: N.A.; Component Class: Resistors; PartId: 100100043
R48 = R0201-10M: Resistor, ±1%, 0.05W; Manufacturer: N.A.; Part number IPS: 00000001426; Note: Chip Res 1%; Pad Count: 2; Part Number: R0201-10M; Manufacturer Part Number: N.A.; LatestRevisionDate: 2014-11-13; Published: 2014-11-13; Value: 10M; Artikkelnr Noca: N.A.; Footprint Doc: 0201; ComponentLink1URL: N.A.; ComponentLink1Description: Datasheet; ComponentLink2URL: N.A.; ComponentLink2Description: Supplier link; HelpURL: N.A.; Supplier 1: N.A.; Supplier Part Number 1: N.A.; Supplier 2: N.A.; Supplier Part Number 2: N.A.; Component Class: Resistors; PartId: 100100105
R50 = R0201-100k: Resistor, ±1%, 0.05W; Manufacturer: N.A.; Part number IPS: 00000001419; Note: Chip Res 1%; Pad Count: 2; Part Number: R0201-100k; Manufacturer Part Number: N.A.; ComponentLink1URL: N.A.; ComponentLink1Description: Datasheet; ComponentLink2URL: N.A.; ComponentLink2Description: Supplier link; HelpURL: N.A.; Footprint Doc: 0201; LatestRevisionDate: 2014-11-13; Published: 2014-11-13; Value: 100k; Artikkelnr Noca: N.A.; Supplier 1: N.A.; Supplier Part Number 1: N.A.; Supplier 2: N.A.; Supplier Part Number 2: N.A.; PartId: 100100080; Component Class: Resistors
R51 = R0201-N.C.: Not mounted; Manufacturer: N.A.; Assembly: Not mounted; Note: Chip Res; Pad Count: 2; Part Number: R0201-N.C.; Manufacturer Part Number: N.A.; ComponentLink1URL: N.A.; ComponentLink1Description: Datasheet; ComponentLink2URL: N.A.; ComponentLink2Description: Supplier link; HelpURL: N.A.; Footprint Doc: 0201; LatestRevisionDate: 2014-11-13; Published: 2014-11-13; Value: N.C.; Artikkelnr Noca: N.A.; Part number IPS: N.A.; Supplier 1: N.A.; Supplier Part Number 1: N.A.; Supplier 2: N.A.; Supplier Part Number 2: N.A.; PartId: 100100107; Component Class: Resistors
SB1 SB3 SB4 = Solderbridge Shorted: Shorted Solderbridge; Manufacturer: N.A.; Pad Count: 2; Part Number: Solderbridge Shorted; Manufacturer Part Number: N.A.; Footprint Doc: Solderbridge_Shorted; LatestRevisionDate: 2012-08-07; Published: 2012-08-07; Value: Solderbridge; Note: N.A.; Artikkelnr Noca: N.A.; Part number IPS: N.A.; ComponentLink1URL: N.A.; ComponentLink1Description: Datasheet; ComponentLink2URL: N.A.; ComponentLink2Description: Supplier link; HelpURL: N.A.; Supplier 1: N.A.; Supplier Part Number 1: N.A.; Supplier 2: N.A.; Supplier Part Number 2: N.A.; Component Class: Connectors; PartId: 100500459
SB2 = Solderbridge: Manufacturer: N.A.; Pad Count: 2; Part Number: Solderbridge; Manufacturer Part Number: N.A.; Footprint Doc: Solderbridge; LatestRevisionDate: 2009-12-14; Published: 2009-12-14; Value: Solderbridge; Note: N.A.; Artikkelnr Noca: N.A.; Part number IPS: N.A.; ComponentLink1URL: N.A.; ComponentLink1Description: Datasheet; ComponentLink2URL: N.A.; ComponentLink2Description: Supplier link; HelpURL: N.A.; Supplier 1: N.A.; Supplier Part Number 1: N.A.; Supplier 2: N.A.; Supplier Part Number 2: N.A.; Component Class: Connectors; PartId: 100500458
ST1-ST5 ST7-ST11 = 2 pin starpoint: Starpoint; Pad Count: 2; Part Number: 2 pin starpoint; Manufacturer: N.A.; Manufacturer Part Number: N.A.; ComponentLink1URL: N.A.; ComponentLink1Description: Datasheet; ComponentLink2URL: N.A.; ComponentLink2Description: Supplier link; HelpURL: N.A.; Footprint Doc: N.A.; LatestRevisionDate: 2017-08-31; Published: 2017-08-31; Value: N.A.; Note: N.A.; Supplier 1: N.A.; Supplier Part Number 1: N.A.; Supplier 2: N.A.; Supplier Part Number 2: N.A.; Artikkelnr Noca: N.A.; Part number IPS: N.A.; Component Class: Connectors; PartId: 100500603
SW1 = Switch-Slide-RA-J-Lead-DPDT-8.5x3.5mm_Copal: SMD slide Switch (ON-ON); Manufacturer: Copal Electronics Inc; Manufacturer Part Number: CL-SB-22A-11T; Part number IPS: 00000007811; Note: N.A.; Pad Count: 6; Part Number: Switch-Slide-RA-J-Lead-DPDT-8.5x3.5mm_Copal; Footprint Doc: Switch-Slide-RA-J-Lead-DPDT-8.5x3.5mm; LatestRevisionDate: 2017-02-01; Published: 2017-02-01; Value: Switch; Artikkelnr Noca: N.A.; ComponentLink1URL: N.A.; ComponentLink1Description: Datasheet; ComponentLink2URL: N.A.; ComponentLink2Description: Supplier link; HelpURL: http://www.nidec-copal-electronics.com/e/catalog/switch/cl-sb.pdf; Supplier 1: Digi-Key; Supplier Part Number 1: 563-1340-1-ND; Supplier 2: Avnet; Supplier Part Number 2: CL-SB-22A-11T; Component Class: Switches; PartId: 101500038
TP11-TP21 = TP_SMD_Ø1.5MM: 1.5mm circular SMD testpad; Manufacturer: Nordic Semiconductor; Manufacturer Part Number: N.A.; Pad Count: 1; Part Number: TP_SMD_Ø1.5MM; Footprint Doc: TP_SMD_Ø1.5mm; LatestRevisionDate: 2016-06-02; Published: 2016-06-02; Value: Ø1.5mm,SMD; Note: N.A.; Artikkelnr Noca: N.A.; Part number IPS: N.A.; ComponentLink1URL: N.A.; ComponentLink1Description: Datasheet; ComponentLink2URL: N.A.; ComponentLink2Description: Supplier link; HelpURL: N.A.; Supplier 1: N.A.; Supplier Part Number 1: N.A.; Supplier 2: N.A.; Supplier Part Number 2: N.A.; Component Class: Connectors; PartId: 100500477
TP22-TP24 = TP_SMD_Ø1.0MM: 1.0mm circular SMD testpad; Manufacturer: Nordic Semiconductor; Manufacturer Part Number: N.A.; Pad Count: 1; Part Number: TP_SMD_Ø1.0MM; Footprint Doc: TP_SMD_Ø1.0mm; LatestRevisionDate: 2013-06-11; Published: 2013-06-11; Value: Ø1.0mm,SMD; Note: N.A.; Artikkelnr Noca: N.A.; Part number IPS: N.A.; ComponentLink1URL: N.A.; ComponentLink1Description: Datasheet; ComponentLink2URL: N.A.; ComponentLink2Description: Supplier link; HelpURL: N.A.; Supplier 1: N.A.; Supplier Part Number 1: N.A.; Supplier 2: N.A.; Supplier Part Number 2: N.A.; Component Class: Connectors; PartId: 100500475
U11 = ADP5360ACBZ: Advanced Battery Management PMIC With Ultralow Iq Buck and Buck-Boost; Manufacturer: Analog Devices; Part number IPS: 80000001823; Note: N.A.; Pad Count: 32; Part Number: ADP5360ACBZ; Manufacturer Part Number: ADP5360ACBZ; ComponentLink1URL: \\hizz\pro\app9717\Datasheet\integated circuits\analog\ADP5360 PRC3 Datasheet_022017.pdf; ComponentLink1Description: Datasheet; ComponentLink2URL: N.A.; ComponentLink2Description: Supplier link; HelpURL: N.A.; Footprint Doc: WLCSP-32; LatestRevisionDate: 2018-09-18; Published: 2018-09-18; Value: ADP5360ACBZ; Supplier 1: N.A.; Supplier Part Number 1: N.A.; Supplier 2: N.A.; Supplier Part Number 2: N.A.; Artikkelnr Noca: N.A.; Component Class: Misc_ICs; PartId: 101900554
U17 = TCK106AG: 1.0 A Load Switch IC with Slew Rate Control Driver in Ultra Small Package; Manufacturer: Toshiba; Manufacturer Part Number: TCK106AG,LF; Part number IPS: 00000004390; Pad Count: 4; Note: N.A.; Part Number: TCK106AG; PartId: 101900575; Component Class: Misc_ICs; ComponentLink1URL: https://toshiba.semicon-storage.com/info/docget.jsp?did=30131&prodName=TCK106AG; ComponentLink1Description: Datasheet; ComponentLink2URL: N.A.; ComponentLink2Description: Supplier link; HelpURL: N.A.; Footprint Doc: WLCSP-4; LatestRevisionDate: 2019-03-01; Published: 2019-02-17; Value: TCK106AG; Supplier 1: Digi-Key; Supplier Part Number 1: TCK106AGLFTR-ND; Supplier 2: Mouser; Supplier Part Number 2: 757-TCK106AGLF; Artikkelnr Noca: N.A.